# EAGLE design pinheader_v8 (EAGLE 9.6.2)
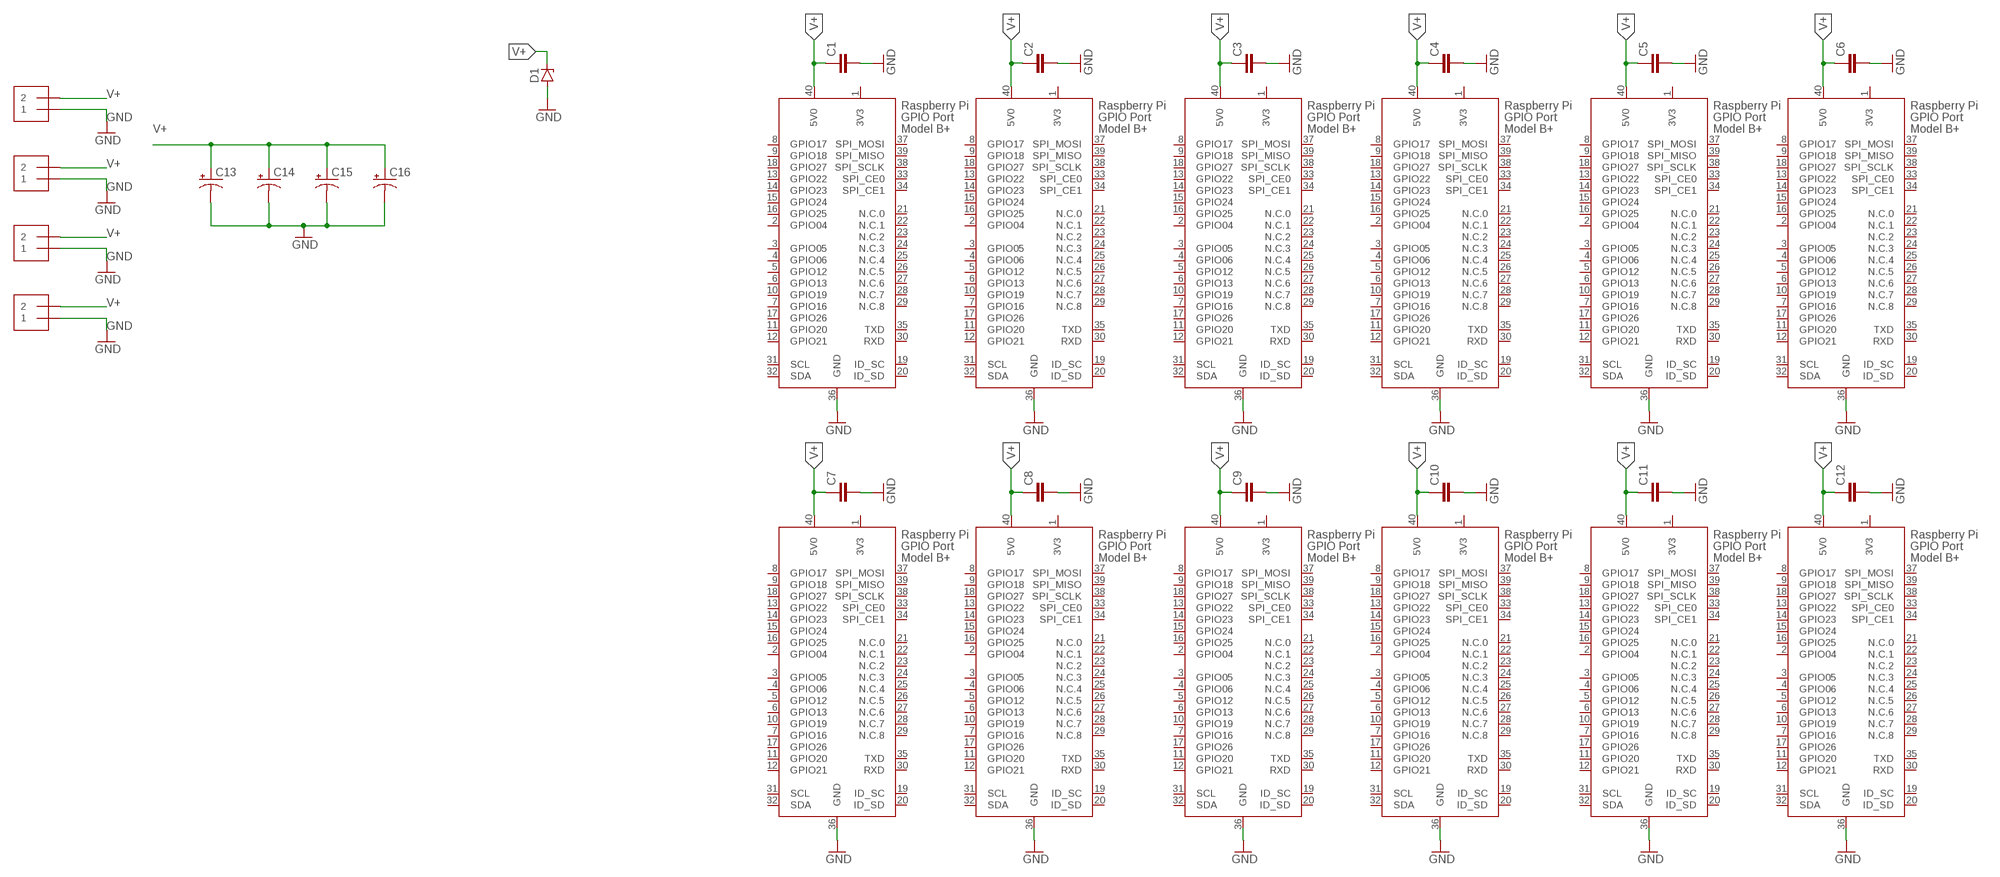
[diagram p0: schematic, sheet 1]

## Parts
C1  C-EUC0603  [C0603]
C2  C-EUC0603  [C0603]
C3  C-EUC0603  [C0603]
C4  C-EUC0603  [C0603]
C5  C-EUC0603  [C0603]
C6  C-EUC0603  [C0603]
C7  C-EUC0603  [C0603]
C8  C-EUC0603  [C0603]
C9  C-EUC0603  [C0603]
C10  C-EUC0603  [C0603]
C11  C-EUC0603  [C0603]
C12  C-EUC0603  [C0603]
C13  CPOL-USE3.5-8  [E3,5-8]
C14  CPOL-USE3.5-8  [E3,5-8]
C15  CPOL-USE3.5-8  [E3,5-8]
C16  CPOL-USE3.5-8  [E3,5-8]
D1  ZENER-DIODESOT223  [SOT223]
U$1  RASPI_GPIO_B+_PWR  [RASPI_GPIO_B+_PIN]
U$2  RASPI_GPIO_B+_PWR  [RASPI_GPIO_B+_PIN]
U$3  RASPI_GPIO_B+_PWR  [RASPI_GPIO_B+_PIN]
U$4  RASPI_GPIO_B+_PWR  [RASPI_GPIO_B+_PIN]
U$5  RASPI_GPIO_B+_PWR  [RASPI_GPIO_B+_PIN]
U$6  RASPI_GPIO_B+_PWR  [RASPI_GPIO_B+_PIN]
U$7  RASPI_GPIO_B+_PWR  [RASPI_GPIO_B+_PIN]
U$8  RASPI_GPIO_B+_PWR  [RASPI_GPIO_B+_PIN]
U$9  RASPI_GPIO_B+_PWR  [RASPI_GPIO_B+_PIN]
U$10  RASPI_GPIO_B+_PWR  [RASPI_GPIO_B+_PIN]
U$11  RASPI_GPIO_B+_PWR  [RASPI_GPIO_B+_PIN]
U$12  RASPI_GPIO_B+_PWR  [RASPI_GPIO_B+_PIN]
U$13  MOLEX_0039301022  [MINI-FIT_JR_CONN]
U$14  MOLEX_0039301022  [MINI-FIT_JR_CONN]
U$15  MOLEX_0039301022  [MINI-FIT_JR_CONN]
U$16  MOLEX_0039301022  [MINI-FIT_JR_CONN]

## Nets
GND: C1.2 C2.2 C3.2 C4.2 C5.2 C6.2 C7.2 C8.2 C9.2 C10.2 C11.2 C12.2 C13.- C14.- C15.- C16.- D1.1(A) U$1.36(GND) U$2.36(GND) U$3.36(GND) U$4.36(GND) U$5.36(GND) U$6.36(GND) U$7.36(GND) U$8.36(GND) U$9.36(GND) U$10.36(GND) U$11.36(GND) U$12.36(GND) U$13.P$2 U$14.P$2 U$15.P$2 U$16.P$2
V+: C1.1 C2.1 C3.1 C4.1 C5.1 C6.1 C7.1 C8.1 C9.1 C10.1 C11.1 C12.1 C13.+ C14.+ C15.+ C16.+ D1.4(C) U$1.40(5V0) U$2.40(5V0) U$3.40(5V0) U$4.40(5V0) U$5.40(5V0) U$6.40(5V0) U$7.40(5V0) U$8.40(5V0) U$9.40(5V0) U$10.40(5V0) U$11.40(5V0) U$12.40(5V0) U$13.P$1 U$14.P$1 U$15.P$1 U$16.P$1
Unconnected: U$1.2(GPIO04) U$1.3(GPIO05) U$1.4(GPIO06) U$1.5(GPIO12) U$1.6(GPIO13) U$1.7(GPIO16) U$1.8(GPIO17) U$1.9(GPIO18) U$1.10(GPIO19) U$1.11(GPIO20) U$1.12(GPIO21) U$1.13(GPIO22) U$1.14(GPIO23) U$1.15(GPIO24) U$1.16(GPIO25) U$1.17(GPIO26) U$1.18(GPIO27) U$1.19(ID_SC) U$1.20(ID_SD) U$1.21(N.C.0) U$1.22(N.C.1) U$1.23(N.C.2) U$1.24(N.C.3) U$1.25(N.C.4) U$1.26(N.C.5) U$1.27(N.C.6) U$1.28(N.C.7) U$1.29(N.C.8) U$1.30(RXD) U$1.31(SCL) U$1.32(SDA) U$1.33(SPI_CE0) U$1.34(SPI_CE1) U$1.35(TXD) U$1.37(SPI_MOSI) U$1.38(SPI_SCLK) U$1.39(SPI_MISO) U$2.2(GPIO04) U$2.3(GPIO05) U$2.4(GPIO06) U$2.5(GPIO12) U$2.6(GPIO13) U$2.7(GPIO16) U$2.8(GPIO17) U$2.9(GPIO18) U$2.10(GPIO19) U$2.11(GPIO20) U$2.12(GPIO21) U$2.13(GPIO22) U$2.14(GPIO23) U$2.15(GPIO24) U$2.16(GPIO25) U$2.17(GPIO26) U$2.18(GPIO27) U$2.19(ID_SC) U$2.20(ID_SD) U$2.21(N.C.0) U$2.22(N.C.1) U$2.23(N.C.2) U$2.24(N.C.3) U$2.25(N.C.4) U$2.26(N.C.5) U$2.27(N.C.6) U$2.28(N.C.7) U$2.29(N.C.8) U$2.30(RXD) U$2.31(SCL) U$2.32(SDA) U$2.33(SPI_CE0) U$2.34(SPI_CE1) U$2.35(TXD) U$2.37(SPI_MOSI) U$2.38(SPI_SCLK) U$2.39(SPI_MISO) U$3.2(GPIO04) U$3.3(GPIO05) U$3.4(GPIO06) U$3.5(GPIO12) U$3.6(GPIO13) U$3.7(GPIO16) U$3.8(GPIO17) U$3.9(GPIO18) U$3.10(GPIO19) U$3.11(GPIO20) U$3.12(GPIO21) U$3.13(GPIO22) U$3.14(GPIO23) U$3.15(GPIO24) U$3.16(GPIO25) U$3.17(GPIO26) U$3.18(GPIO27) U$3.19(ID_SC) U$3.20(ID_SD) U$3.21(N.C.0) U$3.22(N.C.1) U$3.23(N.C.2) U$3.24(N.C.3) U$3.25(N.C.4) U$3.26(N.C.5) U$3.27(N.C.6) U$3.28(N.C.7) U$3.29(N.C.8) U$3.30(RXD) U$3.31(SCL) U$3.32(SDA) U$3.33(SPI_CE0) U$3.34(SPI_CE1) U$3.35(TXD) U$3.37(SPI_MOSI) U$3.38(SPI_SCLK) U$3.39(SPI_MISO) U$4.2(GPIO04) U$4.3(GPIO05) U$4.4(GPIO06) U$4.5(GPIO12) U$4.6(GPIO13) U$4.7(GPIO16) U$4.8(GPIO17) U$4.9(GPIO18) U$4.10(GPIO19) U$4.11(GPIO20) U$4.12(GPIO21) U$4.13(GPIO22) U$4.14(GPIO23) U$4.15(GPIO24) U$4.16(GPIO25) U$4.17(GPIO26) U$4.18(GPIO27) U$4.19(ID_SC) U$4.20(ID_SD) U$4.21(N.C.0) U$4.22(N.C.1) U$4.23(N.C.2) U$4.24(N.C.3) U$4.25(N.C.4) U$4.26(N.C.5) U$4.27(N.C.6) U$4.28(N.C.7) U$4.29(N.C.8) U$4.30(RXD) U$4.31(SCL) U$4.32(SDA) U$4.33(SPI_CE0) U$4.34(SPI_CE1) U$4.35(TXD) U$4.37(SPI_MOSI) U$4.38(SPI_SCLK) U$4.39(SPI_MISO) U$5.2(GPIO04) U$5.3(GPIO05) U$5.4(GPIO06) U$5.5(GPIO12) U$5.6(GPIO13) U$5.7(GPIO16) U$5.8(GPIO17) U$5.9(GPIO18) U$5.10(GPIO19) U$5.11(GPIO20) U$5.12(GPIO21) U$5.13(GPIO22) U$5.14(GPIO23) U$5.15(GPIO24) U$5.16(GPIO25) U$5.17(GPIO26) U$5.18(GPIO27) U$5.19(ID_SC) U$5.20(ID_SD) U$5.21(N.C.0) U$5.22(N.C.1) U$5.23(N.C.2) U$5.24(N.C.3) U$5.25(N.C.4) U$5.26(N.C.5) U$5.27(N.C.6) U$5.28(N.C.7) U$5.29(N.C.8) U$5.30(RXD) U$5.31(SCL) U$5.32(SDA) U$5.33(SPI_CE0) U$5.34(SPI_CE1) U$5.35(TXD) U$5.37(SPI_MOSI) U$5.38(SPI_SCLK) U$5.39(SPI_MISO) U$6.2(GPIO04) U$6.3(GPIO05) U$6.4(GPIO06) U$6.5(GPIO12) U$6.6(GPIO13) U$6.7(GPIO16) U$6.8(GPIO17) U$6.9(GPIO18) U$6.10(GPIO19) U$6.11(GPIO20) U$6.12(GPIO21) U$6.13(GPIO22) U$6.14(GPIO23) U$6.15(GPIO24) U$6.16(GPIO25) U$6.17(GPIO26) U$6.18(GPIO27) U$6.19(ID_SC) U$6.20(ID_SD) U$6.21(N.C.0) U$6.22(N.C.1) U$6.23(N.C.2) U$6.24(N.C.3) U$6.25(N.C.4) U$6.26(N.C.5) U$6.27(N.C.6) U$6.28(N.C.7) U$6.29(N.C.8) U$6.30(RXD) U$6.31(SCL) U$6.32(SDA) U$6.33(SPI_CE0) U$6.34(SPI_CE1) U$6.35(TXD) U$6.37(SPI_MOSI) U$6.38(SPI_SCLK) U$6.39(SPI_MISO) U$7.2(GPIO04) U$7.3(GPIO05) U$7.4(GPIO06) U$7.5(GPIO12) U$7.6(GPIO13) U$7.7(GPIO16) U$7.8(GPIO17) U$7.9(GPIO18) U$7.10(GPIO19) U$7.11(GPIO20) U$7.12(GPIO21) U$7.13(GPIO22) U$7.14(GPIO23) U$7.15(GPIO24) U$7.16(GPIO25) U$7.17(GPIO26) U$7.18(GPIO27) U$7.19(ID_SC) U$7.20(ID_SD) U$7.21(N.C.0) U$7.22(N.C.1) U$7.23(N.C.2) U$7.24(N.C.3) U$7.25(N.C.4) U$7.26(N.C.5) U$7.27(N.C.6) U$7.28(N.C.7) U$7.29(N.C.8) U$7.30(RXD) U$7.31(SCL) U$7.32(SDA) U$7.33(SPI_CE0) U$7.34(SPI_CE1) U$7.35(TXD) U$7.37(SPI_MOSI) U$7.38(SPI_SCLK) U$7.39(SPI_MISO) U$8.2(GPIO04) U$8.3(GPIO05) U$8.4(GPIO06) U$8.5(GPIO12) U$8.6(GPIO13) U$8.7(GPIO16) U$8.8(GPIO17) U$8.9(GPIO18) U$8.10(GPIO19) U$8.11(GPIO20) U$8.12(GPIO21) U$8.13(GPIO22) U$8.14(GPIO23) U$8.15(GPIO24) U$8.16(GPIO25) U$8.17(GPIO26) U$8.18(GPIO27) U$8.19(ID_SC) U$8.20(ID_SD) U$8.21(N.C.0) U$8.22(N.C.1) U$8.23(N.C.2) U$8.24(N.C.3) U$8.25(N.C.4) U$8.26(N.C.5) U$8.27(N.C.6) U$8.28(N.C.7) U$8.29(N.C.8) U$8.30(RXD) U$8.31(SCL) U$8.32(SDA) U$8.33(SPI_CE0) U$8.34(SPI_CE1) U$8.35(TXD) U$8.37(SPI_MOSI) U$8.38(SPI_SCLK) U$8.39(SPI_MISO) U$9.2(GPIO04) U$9.3(GPIO05) U$9.4(GPIO06) U$9.5(GPIO12) U$9.6(GPIO13) U$9.7(GPIO16) U$9.8(GPIO17) U$9.9(GPIO18) U$9.10(GPIO19) U$9.11(GPIO20) U$9.12(GPIO21) U$9.13(GPIO22) U$9.14(GPIO23) U$9.15(GPIO24) U$9.16(GPIO25) U$9.17(GPIO26) U$9.18(GPIO27) U$9.19(ID_SC) U$9.20(ID_SD) U$9.21(N.C.0) U$9.22(N.C.1) U$9.23(N.C.2) U$9.24(N.C.3) U$9.25(N.C.4) U$9.26(N.C.5) U$9.27(N.C.6) U$9.28(N.C.7) U$9.29(N.C.8) U$9.30(RXD) U$9.31(SCL) U$9.32(SDA) U$9.33(SPI_CE0) U$9.34(SPI_CE1) U$9.35(TXD) U$9.37(SPI_MOSI) U$9.38(SPI_SCLK) U$9.39(SPI_MISO) U$10.2(GPIO04) U$10.3(GPIO05) U$10.4(GPIO06) U$10.5(GPIO12) U$10.6(GPIO13) U$10.7(GPIO16) U$10.8(GPIO17) U$10.9(GPIO18) U$10.10(GPIO19) U$10.11(GPIO20) U$10.12(GPIO21) U$10.13(GPIO22) U$10.14(GPIO23) U$10.15(GPIO24) U$10.16(GPIO25) U$10.17(GPIO26) U$10.18(GPIO27) U$10.19(ID_SC) U$10.20(ID_SD) U$10.21(N.C.0) U$10.22(N.C.1) U$10.23(N.C.2) U$10.24(N.C.3) U$10.25(N.C.4) U$10.26(N.C.5) U$10.27(N.C.6) U$10.28(N.C.7) U$10.29(N.C.8) U$10.30(RXD) U$10.31(SCL) U$10.32(SDA) U$10.33(SPI_CE0) U$10.34(SPI_CE1) U$10.35(TXD) U$10.37(SPI_MOSI) U$10.38(SPI_SCLK) U$10.39(SPI_MISO) U$11.2(GPIO04) U$11.3(GPIO05) U$11.4(GPIO06) U$11.5(GPIO12) U$11.6(GPIO13) U$11.7(GPIO16) U$11.8(GPIO17) U$11.9(GPIO18) U$11.10(GPIO19) U$11.11(GPIO20) U$11.12(GPIO21) U$11.13(GPIO22) U$11.14(GPIO23) U$11.15(GPIO24) U$11.16(GPIO25) U$11.17(GPIO26) U$11.18(GPIO27) U$11.19(ID_SC) U$11.20(ID_SD) U$11.21(N.C.0) U$11.22(N.C.1) U$11.23(N.C.2) U$11.24(N.C.3) U$11.25(N.C.4) U$11.26(N.C.5) U$11.27(N.C.6) U$11.28(N.C.7) U$11.29(N.C.8) U$11.30(RXD) U$11.31(SCL) U$11.32(SDA) U$11.33(SPI_CE0) U$11.34(SPI_CE1) U$11.35(TXD) U$11.37(SPI_MOSI) U$11.38(SPI_SCLK) U$11.39(SPI_MISO) U$12.2(GPIO04) U$12.3(GPIO05) U$12.4(GPIO06) U$12.5(GPIO12) U$12.6(GPIO13) U$12.7(GPIO16) U$12.8(GPIO17) U$12.9(GPIO18) U$12.10(GPIO19) U$12.11(GPIO20) U$12.12(GPIO21) U$12.13(GPIO22) U$12.14(GPIO23) U$12.15(GPIO24) U$12.16(GPIO25) U$12.17(GPIO26) U$12.18(GPIO27) U$12.19(ID_SC) U$12.20(ID_SD) U$12.21(N.C.0) U$12.22(N.C.1) U$12.23(N.C.2) U$12.24(N.C.3) U$12.25(N.C.4) U$12.26(N.C.5) U$12.27(N.C.6) U$12.28(N.C.7) U$12.29(N.C.8) U$12.30(RXD) U$12.31(SCL) U$12.32(SDA) U$12.33(SPI_CE0) U$12.34(SPI_CE1) U$12.35(TXD) U$12.37(SPI_MOSI) U$12.38(SPI_SCLK) U$12.39(SPI_MISO)

## Power pins joined to a net without a drawn wire
3V3: U$1.1(3V3) U$2.1(3V3) U$3.1(3V3) U$4.1(3V3) U$5.1(3V3) U$6.1(3V3) U$7.1(3V3) U$8.1(3V3) U$9.1(3V3) U$10.1(3V3) U$11.1(3V3) U$12.1(3V3)

## Library data of the parts
C1-C12 = rcl:C-EU: CAPACITOR, European symbol; SPICEPREFIX: C
C13-C16 = adafruit:CPOL-US: POLARIZED CAPACITOR, American symbol
D1 = diode:ZENER-DIODE: Z-Diode
U$1-U$12 = raspberrypi_bastelstube_v13:RASPI_GPIO_B+_PWR
U$13-U$16 = pat:MOLEX_0039301022

## Board
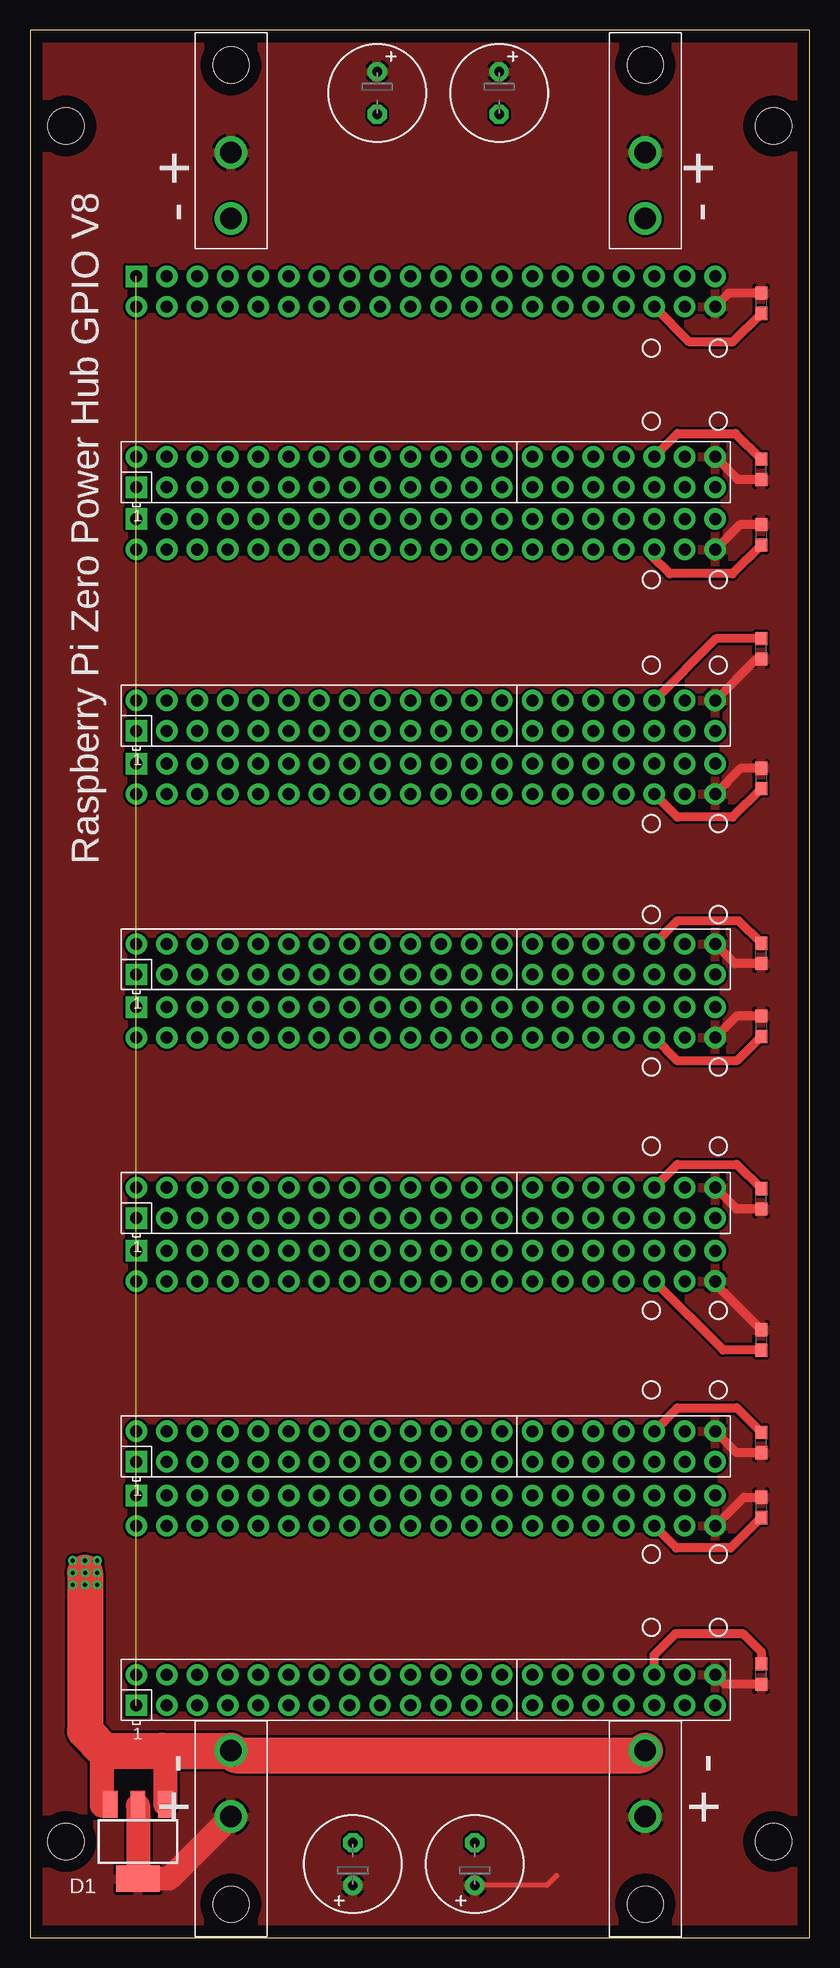
[diagram p1: board, top side]
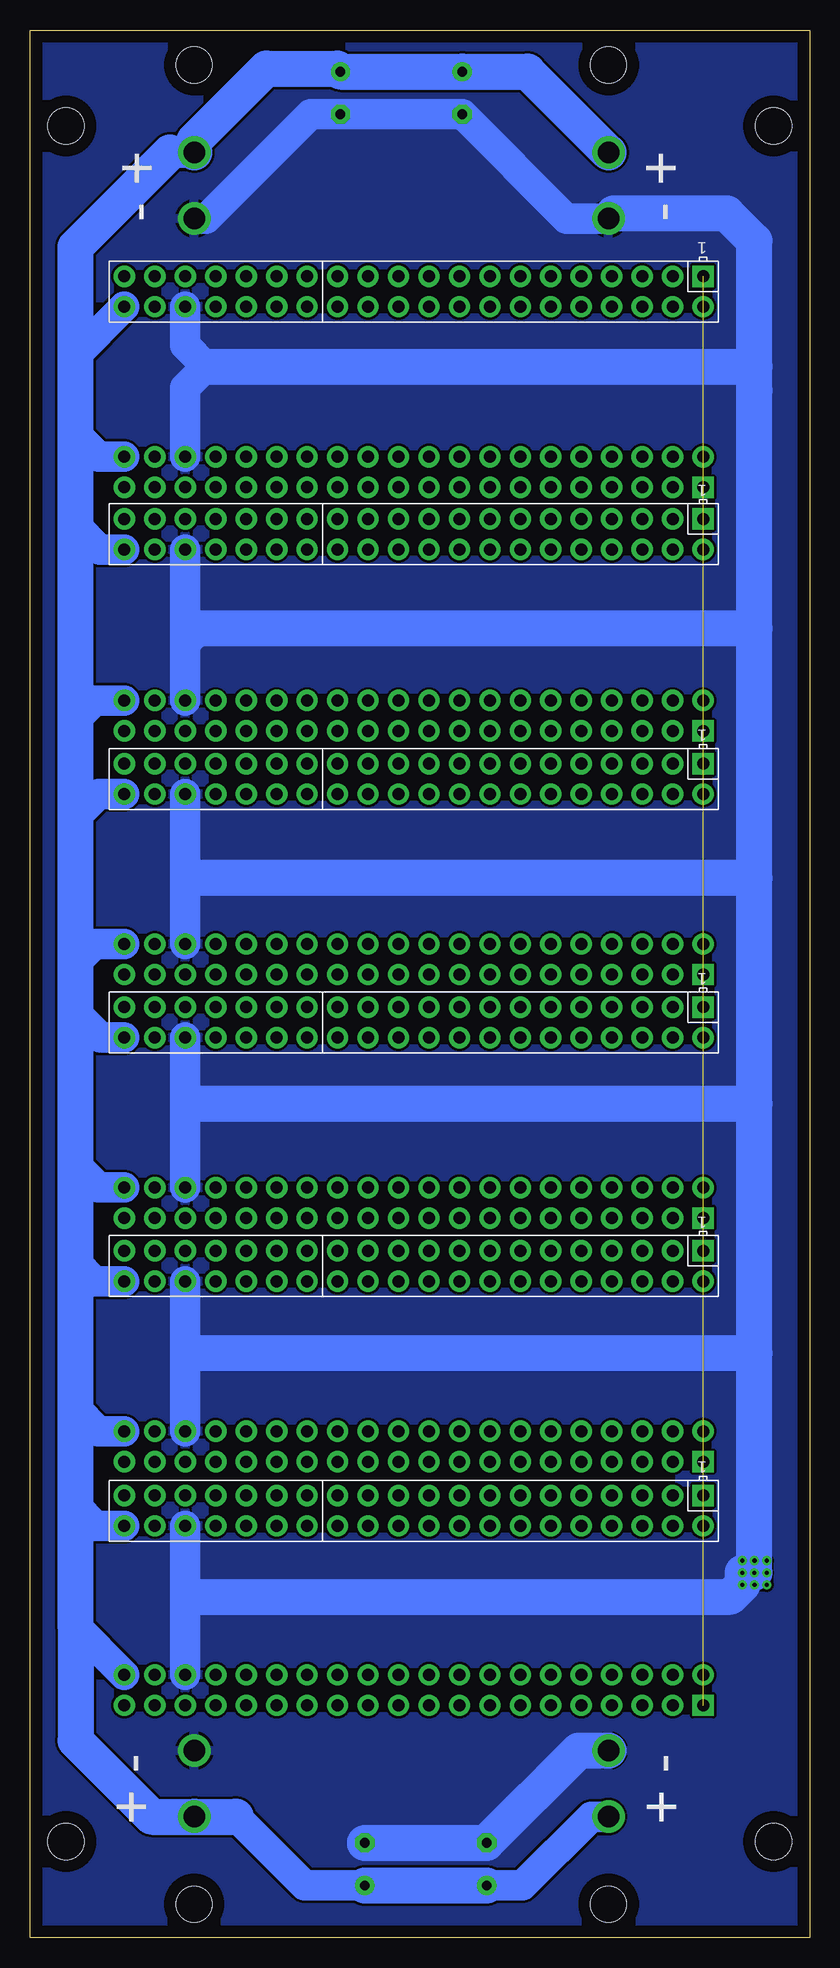
[diagram p2: board, bottom side, seen from below]

Size 65 x 159 mm. Coordinates in mm from the lower left corner, seen from the top.
Outline: 0,0 65,0 65,159 0,159 0,0
Copper layers (1*16): Top 0.035mm / dielectric 1.5mm / Bottom 0.035mm
Design rules "default *": minimum track width 6mil, minimum drill 0.35mm, track to track 8mil, track to pad 8mil, pad to pad 8mil, via to via 8mil, smd to smd 8mil, copper to edge 40mil, drill to drill 6mil, minimum pad ring 0mil, minimum via ring 8mil, stop-mask expansion 4mil, vias tented up to drill 0mil, thermal gap 10mil
Holes 3 mm at 3,8 62,8 3,151 62,151

### Footprints (pad centres in the part's own frame; a part is rotated, then mirrored left to right if it is on the bottom)
C0603 = smd 1.1 x 1: 1 -0.85,0; 2 0.85,0
E3,5-8 = drill 0.813 pad 1.6: + -1.778,0 | drill 0.813 pad 1.6 octagon: - 1.778,0
SOT223 = smd 1.219 x 2.235: 1 -2.311,-3.099; 2 0,-3.099; 3 2.311,-3.099 | smd 3.6 x 2.2: 4 0,3.099
RASPI_GPIO_B+_PIN = drill 1 pad 1.778 square: 1 -24.13,-1.27 | drill 1 pad 1.778: 2 -24.13,1.27; 3 -21.59,-1.27; 4 -21.59,1.27; 5 -19.05,-1.27; 6 -19.05,1.27; 7 -16.51,-1.27; 8 -16.51,1.27; 9 -13.97,-1.27; 10 -13.97,1.27; 11 -11.43,-1.27; 12 -11.43,1.27; 13 -8.89,-1.27; 14 -8.89,1.27; 15 -6.35,-1.27; 16 -6.35,1.27; 17 -3.81,-1.27; 18 -3.81,1.27; 19 -1.27,-1.27; 20 -1.27,1.27; 21 1.27,-1.27; 22 1.27,1.27; 23 3.81,-1.27; 24 3.81,1.27; 25 6.35,-1.27; 26 6.35,1.27; 27 8.89,-1.27; 28 8.89,1.27; 29 11.43,-1.27; 30 11.43,1.27; 31 13.97,-1.27; 32 13.97,1.27; 33 16.51,-1.27; 34 16.51,1.27; 35 19.05,-1.27; 36 19.05,1.27; 37 21.59,-1.27; 38 21.59,1.27; 39 24.13,-1.27; 40 24.13,1.27
MINI-FIT_JR_CONN = drill 1.8: P$1 0,0; P$2 0,5.5 | hole 3: 0,-7.3

### Placement (x,y rotation side)
C1  60.96,21.96 90 top
C2  60.96,35.86 270 top
C3  60.96,75.96 270 top
C4  60.96,61.57 90 top
C5  60.96,49.81 270 top
C6  60.96,41.26 90 top
C7  60.96,82.03 90 top
C8  60.96,122.38 90 top
C9  60.96,136.22 270 top
C10  60.96,96.61 270 top
C11  60.96,107.41 90 top
C12  60.96,116.92 270 top
C13  26.92,6.11 90 top
C14  37.08,6.11 90 top
C15  28.96,153.75 270 top
C16  39.12,153.75 270 top
D1  9,8 180 top
U$1  33,122.15 0 top
U$2  33,101.84 0 top
U$3  33,81.54 0 top
U$4  33,61.24 0 top
U$5  33,40.93 0 top
U$6  33,20.63 0 top
U$7  33,116.98 180 bottom
U$8  33,96.58 180 bottom
U$9  33,137.2 180 bottom
U$10  33,35.58 180 bottom
U$11  33,55.98 180 bottom
U$12  33,76.28 180 bottom
U$13  51.31,10.08 0 top
U$14  16.76,10.08 0 top
U$15  16.76,148.78 180 top
U$16  51.31,148.78 180 top

### Tracks (layer width: path | path; a pad name or v marks a point on that pad's centre or on a via)
3V3  (11 unrouted)
GND  (via drill 0.35)
  Top 0.762: U$6.36 52.05,23.55 53.85,25.35 59.44,25.35 60.96,23.83 C1.2 | C2.2 58.42,32.46 53.89,32.46 U$10.36 | U$5.36 53.99,44.15 58.93,44.15 C6.2 | U$4.36 53.99,64.45 58.93,64.45 C4.2 | C3.2 58.93,73.07 53.98,73.07 U$12.36 | U$3.36 53.99,84.76 59.08,84.76 C7.2 | C10.2 58.57,93.38 53.98,93.38 U$8.36 | C12.2 58.57,113.68 53.34,113.68 51.82,115.2 52.05,115.44 U$7.36 | U$1.36 53.99,125.36 58.83,125.36 C8.2 | C9.2 58.57,132.98 55,132.98 U$9.36 | C11.2 57.2,108.26 U$2.36 | C5.2 57.8,48.96 U$11.36
  Top 2: D1.1 11.31,15.27 11,15.58
  Top 3: v4.59,30.4 4.59,17.19 6.2,15.58 11,15.58 U$14.P$2 17.14,15.21 50.94,15.21 U$13.P$2
  Bottom 2.54: U$9.36 52.05,132.71 50.29,130.95 52.05,129.19 U$1.36 | 50.8,109.12 52.05,107.87 U$2.36 U$7.36 | 51.31,88.31 52.05,87.57 | 52.05,87.57 U$3.36 | U$8.36 52.05,87.57 | 51.82,69.52 52.05,69.75 U$12.36 U$4.36 | 51.82,48.7 52.05,48.94 U$11.36 U$5.36 | 51.82,28.4 52.05,28.17 | 52.05,28.17 U$6.36 | U$10.36 52.05,28.17 | 16.34,143.7 U$15.P$2 20.27,143.28 C15.- C16.- 41.62,151.97 50.31,143.28 U$16.P$2
  Bottom 3: 4.59,48.7 v4.59,30.4 v5.6,30.4 5.6,29.4 6.6,28.4 51.82,28.4 | 4.59,48.7 4.59,69.52 | 4.59,69.52 4.59,88.31 | 4.59,88.31 4.59,109.12 | 4.59,109.12 4.59,128.95 | 4.59,128.95 4.59,130.95 50.29,130.95 | 4.59,128.95 4.59,141.4 6.89,143.7 16.34,143.7 | 4.59,109.12 50.8,109.12 | 4.59,88.31 51.31,88.31 | 51.82,69.52 4.59,69.52 | 4.59,48.7 51.82,48.7 | C14.- C13.- 19.23,15.58 U$14.P$2
  pour Bottom: 0,161.34 65.02,161.34 65.02,0 0,0
N$1  (via drill 0.35)
  other vias: 3.57,30.4
N$2  (via drill 0.35)
  other vias: 4.59,29.38
N$3  (via drill 0.35)
  other vias: 5.6,29.38
N$4
  Top 2: 6,11 6,16
N$5  (via drill 0.35)
  other vias: 3.57,29.38
N$6  (via drill 0.35)
  other vias: 3.57,31.42
N$7  (via drill 0.35)
  other vias: 4.59,31.42
N$8  (via drill 0.35)
  other vias: 5.6,31.42
N$9
  Top 2: 9,11 9,5
V+
  Top 0.406: 43.93,5.18 43.08,4.33 C14.+
  Top 0.762: C1.1 57.92,21.11 U$6.40 | U$10.40 59.53,36.71 C2.1 | C6.1 58.92,40.41 U$5.40 | C4.1 58.92,60.72 U$4.40 | C3.1 58.93,76.81 U$12.40 | C7.1 58.77,81.18 U$3.40 | C10.1 59.29,97.46 U$8.40 | C12.1 59.19,117.77 U$7.40 | C8.1 59.02,121.53 U$1.40 | C9.1 58.27,137.07 U$9.40 | C11.1 60.58,106.56 U$2.40 | U$11.40 57.13,54.49 C5.1
  Top 2: U$14.P$1 11.59,4.9 D1.4
  Bottom 2.54: U$6.40 61.2,25.97 | U$9.40 61.2,131.86 | 61.2,125.35 59.27,123.42 U$1.40 | U$7.40 59.18,115.71 61.2,117.73 | U$2.40 59.6,103.11 61.2,101.52 | U$8.40 59.28,95.31 61.2,93.39 | U$3.40 59.6,82.81 61.2,81.22 | U$12.40 59.09,75.01 61.2,77.12 | U$4.40 59.27,62.51 61.2,64.44 | U$11.40 59.6,54.71 61.2,56.31 | U$5.40 59.27,42.2 61.2,44.13 | U$10.40 59.5,34.31 61.2,36 | 47.83,10.08 42.08,4.33 C14.+ | C13.+ 23.92,4.33 18.18,10.08 U$14.P$1 | 53.34,148.78 U$16.P$1
  Bottom 3: 47.83,10.08 U$13.P$1 54.86,10.08 61.2,16.41 61.2,25.97 61.2,36 61.2,44.13 61.2,56.31 61.2,64.44 61.2,77.12 61.2,81.22 61.2,93.39 61.2,101.52 61.2,117.73 61.2,125.35 61.2,131.86 61.2,140.92 53.34,148.78 | C14.+ C13.+ | U$16.P$1 51.31,149.78 45.31,155.78 39.37,155.78 C16.+ C15.+ 23.51,155.53 U$15.P$1
  pour Top: -9,160.34 65.02,160.34 65.02,-0.51 -9,-0.51

### Text on the board
tPlace: - + | - + | Raspberry Pi Zero Power Hub GPIO V8 | + - | + -
bPlace: - + | - + | + - | + -